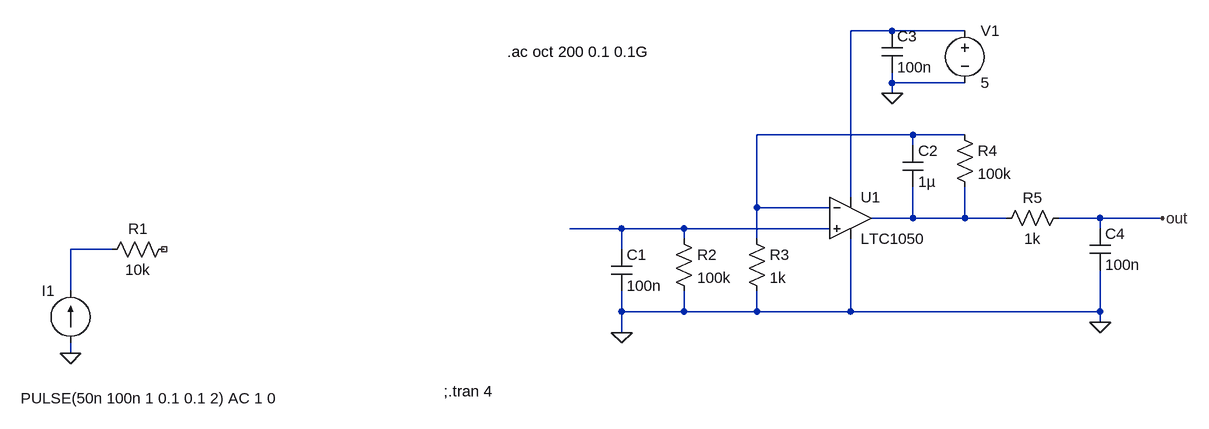
[diagram p0: schematic Draft1.asc]
Draft1.asc, the LTspice schematic file:
Version 4
SHEET 1 880 680
WIRE 320 -144 256 -144
WIRE 432 -144 320 -144
WIRE 320 -64 320 -80
WIRE 432 -64 320 -64
WIRE 320 -48 320 -64
WIRE 352 16 112 16
WIRE 432 16 352 16
WIRE 352 32 352 16
WIRE 256 112 256 -144
WIRE 112 128 112 16
WIRE 224 128 112 128
WIRE 352 144 352 96
WIRE 352 144 288 144
WIRE 432 144 432 96
WIRE 432 144 352 144
WIRE 496 144 432 144
WIRE 640 144 576 144
WIRE 736 144 640 144
WIRE -96 160 -176 160
WIRE 0 160 -96 160
WIRE 224 160 0 160
WIRE 640 160 640 144
WIRE 0 176 0 160
WIRE 112 176 112 128
WIRE -880 192 -944 192
WIRE -96 192 -96 160
WIRE -944 256 -944 192
WIRE -96 288 -96 256
WIRE 0 288 0 256
WIRE 0 288 -96 288
WIRE 112 288 112 256
WIRE 112 288 0 288
WIRE 256 288 256 176
WIRE 256 288 112 288
WIRE 640 288 640 224
WIRE 640 288 256 288
WIRE 640 304 640 288
WIRE -96 320 -96 288
WIRE -944 352 -944 336
FLAG -96 320 0
FLAG 640 304 0
FLAG 320 -48 0
FLAG 736 144 out
FLAG -944 352 0
SYMBOL res -784 176 R90
WINDOW 0 0 56 VBottom 2
WINDOW 3 32 56 VTop 2
SYMATTR InstName R1
SYMATTR Value 10k
SYMBOL cap -112 192 R0
SYMATTR InstName C1
SYMATTR Value 100n
SYMBOL res -16 160 R0
SYMATTR InstName R2
SYMATTR Value 100k
SYMBOL res 96 160 R0
SYMATTR InstName R3
SYMATTR Value 1k
SYMBOL cap 336 32 R0
SYMATTR InstName C2
SYMATTR Value 1µ
SYMBOL res 416 0 R0
SYMATTR InstName R4
SYMATTR Value 100k
SYMBOL cap 304 -144 R0
SYMATTR InstName C3
SYMATTR Value 100n
SYMBOL res 592 128 R90
WINDOW 0 0 56 VBottom 2
WINDOW 3 32 56 VTop 2
SYMATTR InstName R5
SYMATTR Value 1k
SYMBOL cap 624 160 R0
SYMATTR InstName C4
SYMATTR Value 100n
SYMBOL voltage 432 -160 R0
WINDOW 123 0 0 Left 0
WINDOW 39 0 0 Left 0
SYMATTR InstName V1
SYMATTR Value 5
SYMBOL current -944 336 R180
WINDOW 0 24 80 Left 2
WINDOW 3 -321 -85 Left 2
WINDOW 123 0 0 Left 0
WINDOW 39 0 0 Left 0
SYMATTR InstName I1
SYMATTR Value PULSE(50n 100n 1 0.1 0.1 2) AC 1 0
SYMBOL OpAmps\\LTC1050 256 80 R0
SYMATTR InstName U1
TEXT -370 410 Left 2 !;.tran 4
TEXT -272 -112 Left 2 !.ac oct 200 0.1 0.1G

The netlist it stands for:
* Draft1.asc
R1 NC_01 N005 10k
C1 N004 0 100n
R2 N004 0 100k
R3 N002 0 1k
C2 N002 N003 1µ
R4 N002 N003 100k
C3 N001 0 100n
R5 out N003 1k
C4 out 0 100n
V1 N001 0 5
I1 0 N005 PULSE(50n 100n 1 0.1 0.1 2) AC 1 0
XU1 N004 N002 N001 0 N003 LTC1050  ; pins In+ In- V+ V- OUT
;.tran 4
.ac oct 200 0.1 0.1G
.lib LTC.lib
.backanno
.end